# EAGLE schematic Riego_Auto (EAGLE 6.6.0)
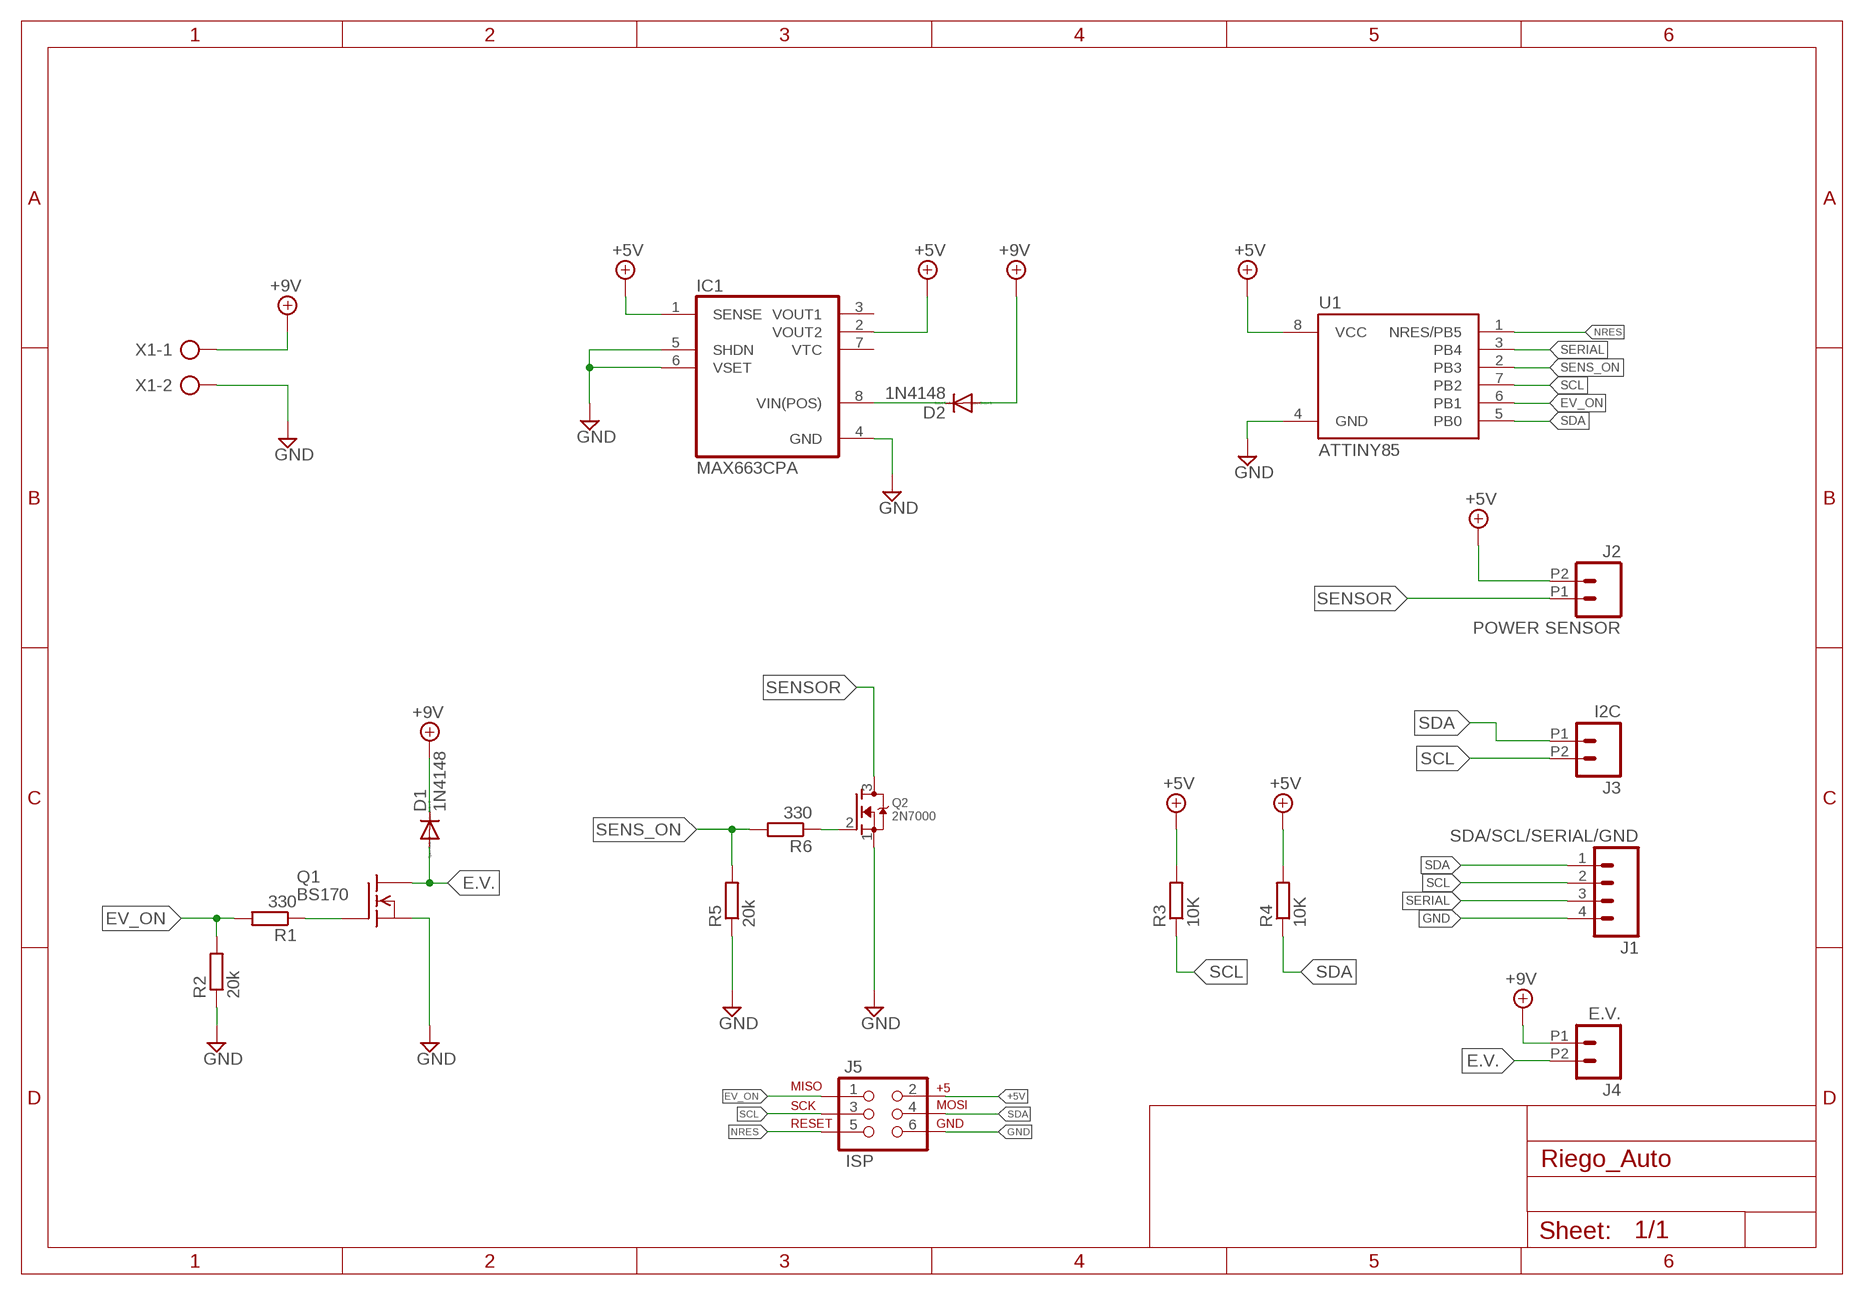
[diagram p0: schematic, sheet 1]

## Parts
D1  1N4148  1N4148DO35-7  [DO35-7]
D2  1N4148  1N4148DO35-7  [DO35-7]
IC1  MAX663CPA  [DIL08]
J1  SDA/SCL/SERIAL/GND  M04PTH  [1X04]
J2  POWER SENSOR  M022.54MM_SCREWTERM  [1X02_2.54_SCREWTERM]
J3  I2C  M022.54MM_SCREWTERM  [1X02_2.54_SCREWTERM]
J4  E.V.  M022.54MM_SCREWTERM  [1X02_2.54_SCREWTERM]
J5  ISP  AVR_SPI_PRG_6PTH  [2X3]
Q1  BS170  FQN1N50CI  [TO92-INLINE]
Q2  2N7000  MOSFET-N  [TO92-INLINE]
R1  330  R-EU_0204/7  [0204/7]
R2  20k  R-EU_0204/7  [0204/7]
R3  10K  R-EU_0204/7  [0204/7]
R4  10K  R-EU_0204/7  [0204/7]
R5  20k  R-EU_0204/7  [0204/7]
R6  330  R-EU_0204/7  [0204/7]
U1  ATTINY85  ATTINY85DIL  [DIL08]
X1  AK500/2  [AK500/2]

## Nets
+5V: IC1.1(SENSE) IC1.2(VOUT2) J2.P2 J5.2 R3.2 R4.2 U1.8(VCC)
+12V: D1.C D2.A J4.P1 X1.1 ; supply symbol labelled +9V
E.V.: D1.A J4.P2 Q1.1(D)
EV_ON: J5.1 R1.2 R2.2 U1.6(PB1)
GND: IC1.4(GND) IC1.5(SHDN) IC1.6(VSET) J1.4 J5.6 Q1.3(S) Q2.1(S) R2.1 R5.1 U1.4(GND) X1.2
N$1: Q1.2(G) R1.1
N$2: D2.C IC1.8(VIN(POS))
N$3: Q2.2(G) R6.1
NRES: J5.5 U1.1(NRES/PB5)
SCL: J1.2 J3.P2 J5.3 R3.1 U1.7(PB2)
SDA: J1.1 J3.P1 J5.4 R4.1 U1.5(PB0)
SENS_ON: R5.2 R6.2 U1.2(PB3)
SENSOR: J2.P1 Q2.3(D)
SERIAL: J1.3 U1.3(PB4)
Unconnected: IC1.3(VOUT1) IC1.7(VTC)

## Library data of the parts
D1 D2 = diode:1N4148: DIODE high speed (Philips)
IC1 = maxim:MAX663CPA: Positive VOLTAGE REGULATOR; MPN: MAX663CPA+; OC_FARNELL: unknown; OC_NEWARK: 03M8949
J1 = SparkFun-Connectors:M04: Header 4 Standard 4-pin 0.1" header. Use with straight break away headers (SKU : PRT-00116), right angle break away headers (PRT-00553), swiss pins (PRT-00743), machine pins (PRT-00117), and female headers (PRT-00115). Molex polarized connector foot print use with SKU : PRT-08231 with associated crimp pins and housings. 1MM SMD Version SKU: PRT-10208; PROD_ID: CONN-09696
J2-J4 = SparkFun-Connectors:M02: Standard 2-pin 0.1" header. Use with - straight break away headers ( PRT-00116) - right angle break away headers (PRT-00553) - swiss pins (PRT-00743) - machine pins (PRT-00117) - female headers (PRT-00115) Molex polarized connector foot print use with: PRT-08233 with associated crimp pins and housings. 2.54_SCREWTERM for use with PRT-10571. 3.5mm Screw Terminal footprints for PRT-08084 5mm Screw Terminal footprints for use with PRT-08432
J5 = SparkFun-Connectors:AVR_SPI_PRG_6: AVR ISP 6 Pin This is the reduced ISP connector for AVR programming. Common on Arduino. This footprint will take up less PCB space and can be used with a 10-pin to 6-pin adapter such as SKU: BOB-08508 **Special note about "TEST_POINT" package. The stop mask is on the top side, so if you want your programming test points to be on the bottom of your board, make sure to place this package on the bottom side of the board. This also ensure that the orientation to program from the bottom side will be correct.
Q1 = adafruit:FQN1N50C: N-Channel Enhancement MOSFET 500V, 0.4A, 6.0 Ohm
Q2 = Mi_libreria:MOSFET-N: N-Channel Mosfet 2N7000 - 60V 200mA TO-92
R1-R6 = resistor:R-EU_: RESISTOR, European symbol
U1 = attiny85:ATTINY85: ATMEL ATtiny 85
X1 = con-ptr500:AK500/2: CONNECTOR; OC_FARNELL: unknown; OC_NEWARK: unknown